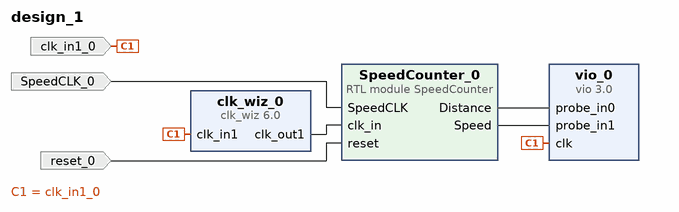
[diagram p0: block diagram of the top level]
# Vivado block design design_1, xc7z020clg400-1, Vivado 2023.2
create_bd_design design_1

create_bd_port -dir I -type clk clk_in1_0
create_bd_port -dir I SpeedCLK_0
create_bd_port -dir I -type rst reset_0

create_bd_cell -type module -reference SpeedCounter SpeedCounter_0
create_bd_cell -type ip -vlnv xilinx.com:ip:clk_wiz:6.0 clk_wiz_0
set_property -dict {CONFIG.USE_LOCKED false CONFIG.USE_RESET false} [get_bd_cells clk_wiz_0]
create_bd_cell -type ip -vlnv xilinx.com:ip:vio:3.0 vio_0
set_property -dict {CONFIG.C_NUM_PROBE_IN 2 CONFIG.C_NUM_PROBE_OUT 0} [get_bd_cells vio_0]

# ---- connections ----

connect_bd_net -net SpeedCLK_0_1 [get_bd_ports SpeedCLK_0] [get_bd_pins SpeedCounter_0/SpeedCLK]
connect_bd_net [get_bd_pins SpeedCounter_0/Distance] [get_bd_pins vio_0/probe_in0]
connect_bd_net [get_bd_pins SpeedCounter_0/Speed] [get_bd_pins vio_0/probe_in1]
connect_bd_net -net clk_in1_0_1 [get_bd_ports clk_in1_0] [get_bd_pins clk_wiz_0/clk_in1] [get_bd_pins vio_0/clk]
connect_bd_net [get_bd_pins clk_wiz_0/clk_out1] [get_bd_pins SpeedCounter_0/clk_in]
connect_bd_net -net reset_0_1 [get_bd_ports reset_0] [get_bd_pins SpeedCounter_0/reset]

validate_bd_design
save_bd_design
